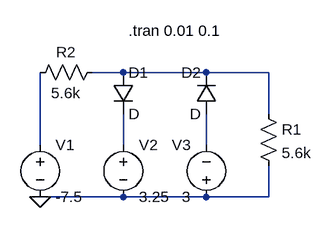
[diagram p0: schematic Draft33.asc]
Draft33.asc, the LTspice schematic file:
Version 4
SHEET 1 880 680
WIRE 272 176 224 176
WIRE 400 176 272 176
WIRE 496 176 400 176
WIRE 496 240 496 176
WIRE 144 288 144 176
WIRE 272 288 272 240
WIRE 400 288 400 240
WIRE 272 368 144 368
WIRE 400 368 272 368
WIRE 496 368 496 320
WIRE 496 368 400 368
FLAG 144 368 0
SYMBOL voltage 144 272 R0
SYMATTR InstName V1
SYMATTR Value -7.5
SYMBOL voltage 272 272 R0
SYMATTR InstName V2
SYMATTR Value 3.25
SYMBOL voltage 400 384 R180
WINDOW 0 24 96 Left 2
WINDOW 3 24 16 Left 2
SYMATTR InstName V3
SYMATTR Value 3
SYMBOL diode 256 176 R0
SYMATTR InstName D1
SYMBOL diode 416 240 R180
WINDOW 0 24 64 Left 2
WINDOW 3 24 0 Left 2
SYMATTR InstName D2
SYMBOL res 480 224 R0
SYMATTR InstName R1
SYMATTR Value 5.6k
SYMBOL res 240 160 R90
WINDOW 0 0 56 VBottom 2
WINDOW 3 32 56 VTop 2
SYMATTR InstName R2
SYMATTR Value 5.6k
TEXT 280 112 Left 2 !.tran 0.01 0.1

The netlist it stands for:
* Draft33.asc
V1 N002 0 -7.5
V2 N003 0 3.25
V3 0 N004 3
D1 N001 N003 D
D2 N004 N001 D
R1 N001 0 5.6k
R2 N001 N002 5.6k
.model D D
.lib standard.dio
.tran 0.01 0.1
.backanno
.end